# EAGLE design cir23 (EAGLE 7.6.0)
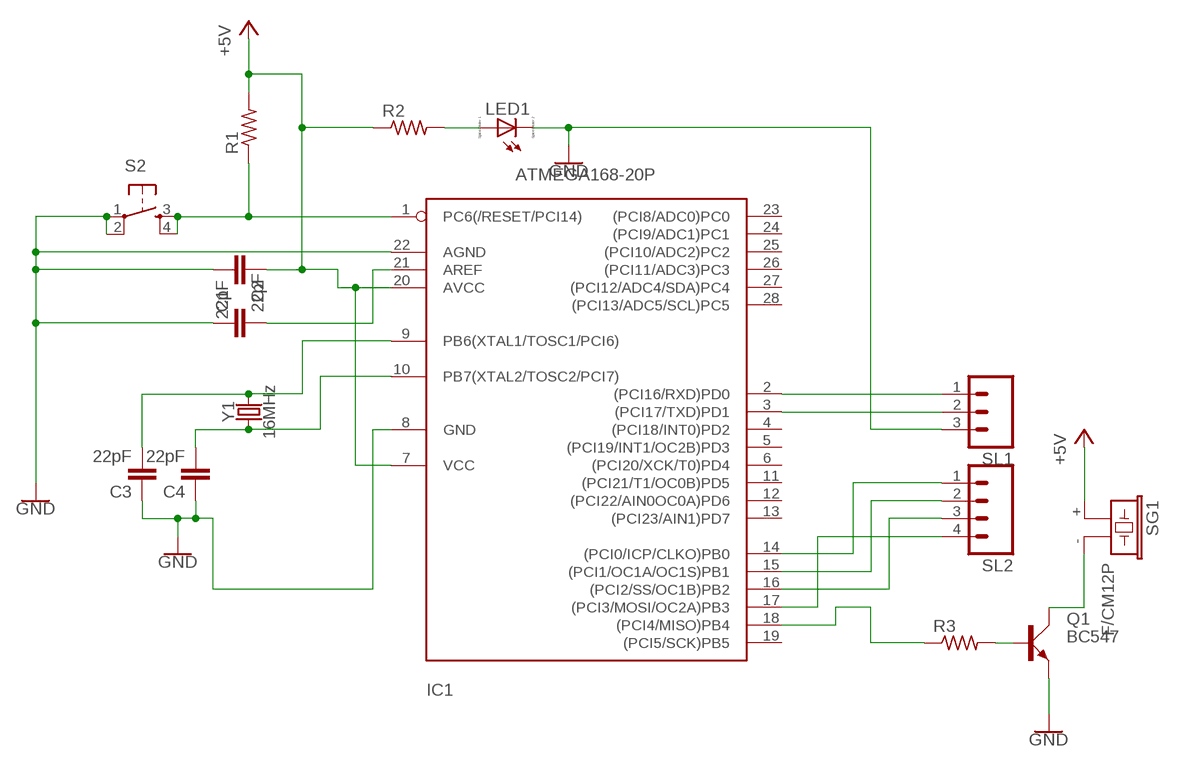
[diagram p0: schematic, sheet 1]

## Parts
C1  22pF  22PF-PTH-2.54MM-200V-5%  [CAP-PTH-2.54]
C2  22pF  22PF-PTH-2.54MM-200V-5%  [CAP-PTH-2.54]
C3  22pF  22PF-PTH-2.54MM-200V-5%  [CAP-PTH-2.54]
C4  22pF  22PF-PTH-2.54MM-200V-5%  [CAP-PTH-2.54]
IC1  ATMEGA168-20P  [DIL28-3]
LED1  LED_ELD260  [LED_LD260]
Q1  BC547  [SOT54A]
R1  R-US_0204/7  [0204/7]
R2  R-US_0204/7  [0204/7]
R3  R-US_0204/7  [0204/7]
S2  TAC_SWITCHPTH  [TACTILE-PTH]
SG1  F/CM12P  [F/CM12P]
SL1  MA03  [03P]
SL2  MA04  [04PA]
Y1  16MHz  CRYSTAL-16MHZPTH-HC49US  [HC49US]

## Nets
+5V: C2.1 IC1.7(VCC) IC1.20(AVCC) R1.2 R2.1 SG1.+
GND: C1.1 C2.2 C3.1 C4.1 IC1.8(GND) IC1.22(AGND) LED1.K(C) Q1.E S2.1 S2.2 SL1.3
N$1: IC1.1(PC6(/RESET/PCI14)) R1.1 S2.3 S2.4
N$2: IC1.14((PCI0/ICP/CLKO)PB0) SL2.1
N$3: C1.2 IC1.21(AREF)
N$4: C3.2 IC1.9(PB6(XTAL1/TOSC1/PCI6)) Y1.2
N$5: C4.2 IC1.10(PB7(XTAL2/TOSC2/PCI7)) Y1.1
N$6: IC1.15((PCI1/OC1A/OC1S)PB1) SL2.2
N$7: IC1.16((PCI2/SS/OC1B)PB2) SL2.3
N$8: IC1.17((PCI3/MOSI/OC2A)PB3) SL2.4
N$9: IC1.18((PCI4/MISO)PB4) R3.1
N$10: LED1.A R2.2
N$11: IC1.2((PCI16/RXD)PD0) SL1.1
N$12: IC1.3((PCI17/TXD)PD1) SL1.2
N$13: Q1.B R3.2
N$14: Q1.C SG1.-
Unconnected: IC1.4((PCI18/INT0)PD2) IC1.5((PCI19/INT1/OC2B)PD3) IC1.6((PCI20/XCK/T0)PD4) IC1.11((PCI21/T1/OC0B)PD5) IC1.12((PCI22/AIN0OC0A)PD6) IC1.13((PCI23/AIN1)PD7) IC1.19((PCI5/SCK)PB5) IC1.23((PCI8/ADC0)PC0) IC1.24((PCI9/ADC1)PC1) IC1.25((PCI10/ADC2)PC2) IC1.26((PCI11/ADC3)PC3) IC1.27((PCI12/ADC4/SDA)PC4) IC1.28((PCI13/ADC5/SCL)PC5)

## Library data of the parts
C1-C4 = SparkFun-Capacitors:22PF: 22pF ceramic capacitors A capacitor is a passive two-terminal electrical component used to store electrical energy temporarily in an electric field.; PROD_ID: CAP-09128
IC1 = adafruit:ATMEGA168*P: MICROCONTROLLER 16 kBytes FLASH 1 kBytes SRAM 512 Bytes EEPROM USART 8-channel 10 bit ADC
LED1 = eagle-ltspice:LED_E: LED Source: http://www.osram.convergy.de Source: www.luxeon.com Source: www.kingbright.com; SPICEMODEL: NONE; SPICEPREFIX: D; SPICETYPE: diode
Q1 = transistor-small-signal:BC547: NPN TRANSISTOR
R1-R3 = rcl:R-US_: RESISTOR, American symbol
S2 = SparkFun-Retired:TAC_SWITCH: Momentary Switch Button commonly used for reset or general input. Spark Fun Electronics SKU : COM-00097 SMT- SWCH-08247
SG1 = buzzer:F/CM12P: BUZZER Source: Buerklin; OC_FARNELL: unknown; OC_NEWARK: unknown
SL1 = con-amp-quick:MA03: AMP QUICK CONNECTOR; OC_FARNELL: unknown; OC_NEWARK: unknown
SL2 = con-amp-quick:MA04: AMP QUICK CONNECTOR; OC_FARNELL: unknown; OC_NEWARK: unknown
Y1 = SparkFun-Clocks:CRYSTAL-16MHZ: 16MHz Crystal Digikey Example <http://www.digikey.com/product-search/en?keywords=535-9122-1-ND> Frequency: 16MHz Frequency Stability: ±50ppm Frequency Tolerance: ±20ppm Load Capacitance: 18pF SparkFun Products: Pro Micro -5V/16MHz <https://www.sparkfun.com/products/12640> SparkFun Serial Enabled LCD Kit <https://www.sparkfun.com/products/10097>; PROD_ID: XTAL-08181; SF_ID: COM-00536

## Board
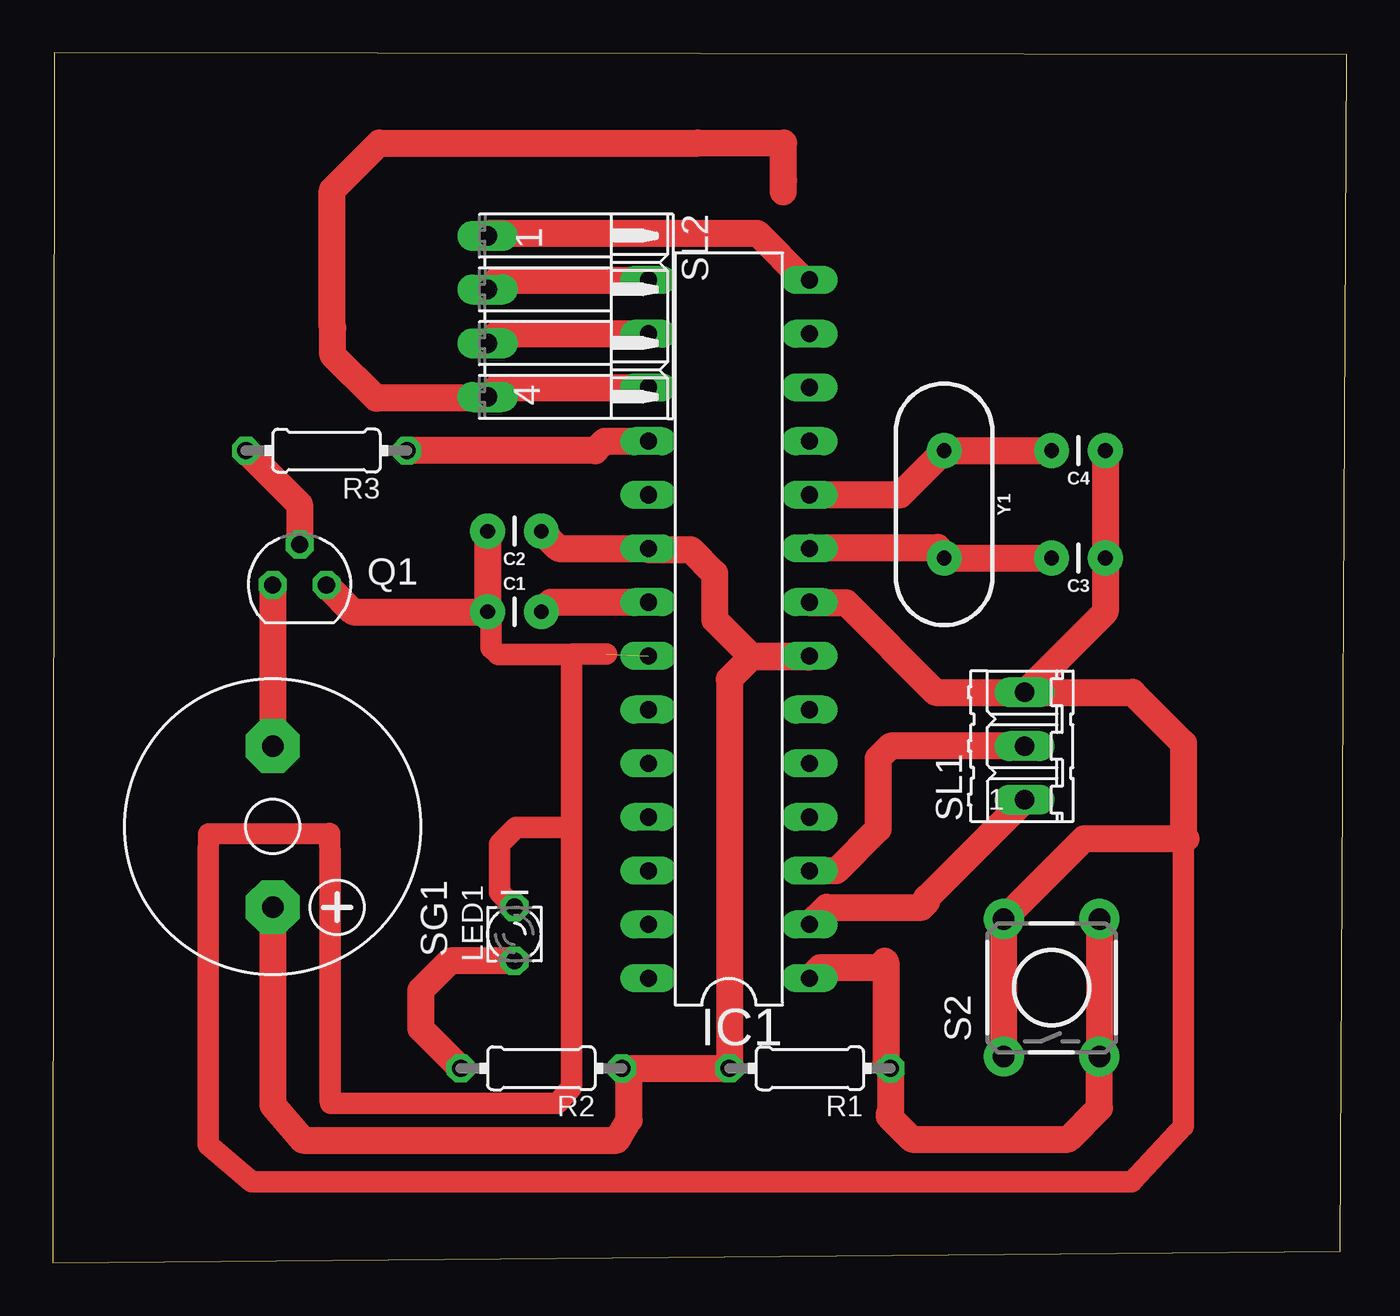
[diagram p1: board, top side]

Size 61.18 x 57.22 mm. Coordinates in mm from the lower left corner, seen from the top.
Outline: 0,0 60.88,0.55 61.18,57.13 0.05,57.22 0,0
Copper layers (1*16): Top 0.035mm / dielectric 1.5mm / Bottom 0.035mm
Design rules "default": minimum track width 10mil, minimum drill 24mil, track to track 8mil, track to pad 8mil, pad to pad 8mil, via to via 8mil, smd to smd 8mil, copper to edge 40mil, drill to drill 8mil, minimum pad ring 10mil, minimum via ring 8mil, stop-mask expansion 4mil, vias tented up to drill 0mil, thermal gap 10mil

### Footprints (pad centres in the part's own frame; a part is rotated, then mirrored left to right if it is on the bottom)
CAP-PTH-2.54 = drill 0.7 pad 1.651: 1 -1.27,0; 2 1.27,0
DIL28-3 = drill 0.813 long: 1 -16.51,-3.81; 2 -13.97,-3.81; 3 -11.43,-3.81; 4 -8.89,-3.81; 5 -6.35,-3.81; 6 -3.81,-3.81; 7 -1.27,-3.81; 8 1.27,-3.81; 9 3.81,-3.81; 10 6.35,-3.81; 11 8.89,-3.81; 12 11.43,-3.81; 13 13.97,-3.81; 14 16.51,-3.81; 15 16.51,3.81; 16 13.97,3.81; 17 11.43,3.81; 18 8.89,3.81; 19 6.35,3.81; 20 3.81,3.81; 21 1.27,3.81; 22 -1.27,3.81; 23 -3.81,3.81; 24 -6.35,3.81; 25 -8.89,3.81; 26 -11.43,3.81; 27 -13.97,3.81; 28 -16.51,3.81
LED_LD260 = drill 0.813 octagon: A -1.27,0; K 1.27,0
SOT54A = drill 0.813 octagon: B 0,1.905; C -1.27,0; E 1.27,0
0204/7 = drill 0.813 octagon: 1 -3.81,0; 2 3.81,0
TACTILE-PTH = drill 1.016 pad 1.88: 1 -3.251,2.261; 2 3.251,2.261; 3 -3.251,-2.261; 4 3.251,-2.261
F/CM12P = drill 1.016 pad 2.54 octagon: + 3.81,0; - -3.81,0
03P = drill 0.914 long: 1 -2.54,0; 2 0,0; 3 2.54,0
04PA = drill 0.914 long: 1 -3.81,0; 2 -1.27,0; 3 1.27,0; 4 3.81,0
HC49US = drill 0.7 pad 1.651: 1 -2.54,0; 2 2.54,0

### Placement (x,y rotation side)
C1  21.83,30.79 0 top
C2  21.83,34.6 180 top
C3  48.5,33.33 180 top
C4  48.5,38.41 180 top
IC1  31.97,29.97 90 top
LED1  21.83,15.55 90 top
Q1  11.67,32.06 0 top
R1  35.8,9.2 180 top
R2  23.1,9.2 180 top
R3  12.94,38.41 180 top
S2  47.23,13.01 90 top
SG1  10.4,20.63 270 top
SL1  45.96,24.44 90 top
SL2  20.56,44.76 270 top
Y1  42.15,35.87 270 top

### Tracks (layer width: path | path; a pad name or v marks a point on that pad's centre or on a via)
+5V
  Top 1.27: SG1.+ 10.4,7.48 11.83,5.81 26.67,5.81 27.25,6.76 27.25,8.86 R2.1 R1.2 31.99,27.61 33.03,28.65 35.73,28.65 IC1.7 33.01,28.7 31.29,30.42 31.29,32.61 30.17,33.73 28.22,33.73 IC1.20 23.92,33.78 C2.1
GND  (1 unrouted)
  Top 1.016: 26.19,28.8 24.58,28.8 24.54,28.76 | 24.54,28.76 24.54,20.6 | 24.54,20.6 24.54,8.32 23.88,7.55 13.14,7.55 13.1,7.7 13.1,18.97 13.09,20.32 7.37,20.29 7.33,19.22 7.33,5.59 9.4,3.84 51.02,3.84 53.46,6.45 53.46,20.56 | C1.1 20.71,30.64 20.71,29.09 21.04,28.76 24.54,28.76 | LED1.K 21.12,17.53 21.12,19.81 21.91,20.6 24.54,20.6
  Top 1.27: S2.1 S2.2 48.76,20.06 53.58,20.06 53.46,20.17 53.46,20.56 53.46,24.58 51.05,26.98 SL1.3 | C2.2 C1.1 14.21,30.79 Q1.E | C4.1 C3.1 49.77,30.79 SL1.3 | IC1.8 35.8,31.22 37.5,31.22 41.74,26.98 SL1.3
N$1
  Top 1.27: S2.4 S2.3 49.49,7.33 48.01,5.85 40.63,5.85 39.54,6.94 39.54,7.04 39.61,7.11 R1.1 39.39,9.42 39.39,13.97 | 39.34,14.28 39.39,14.23 39.39,13.97 | IC1.1 36.29,13.97 39.39,13.97
N$2
  Top 1.27: SL2.1 20.68,48.7 33.31,48.7 35.52,46.48 IC1.14
N$3
  Top 1.27: C1.2 23.55,31.24 IC1.21
N$4
  Top 1.27: C3.2 Y1.2 42.15,33.53 41.84,33.84 35.84,33.84 IC1.9
N$5
  Top 1.27: C4.2 Y1.1 40.06,36.32 IC1.10
N$6
  Top 1.27: SL2.2 21.01,46.48 IC1.15
N$7
  Top 1.27: SL2.3 21.01,43.94 IC1.16
N$8
  Top 1.27: 34.56,51.19 34.53,51.15 | 34.53,51.15 34.53,50.65 | 34.53,51.15 34.53,52.93 34.57,52.97 30.5,52.95 15.43,52.95 13.21,50.73 13.21,44.23 13.23,44.21 13.23,42.94 15.29,40.89 20.49,40.89 SL2.4 21.01,41.4 IC1.17
N$9
  Top 1.27: R3.1 25.64,38.41 26.09,38.86 IC1.18
N$10
  Top 1.27: LED1.A 18.78,14.28 17.4,12.9 17.4,11.09 R2.2
N$11
  Top 1.27: SL1.1 41.33,17.27 41.33,17.08 41.07,16.82 36.6,16.82 IC1.2
N$12
  Top 1.27: SL1.2 39.61,24.44 39.02,23.86 39.02,20.51 37.05,18.54 IC1.3
N$13
  Top 1.27: R3.2 11.67,35.87 Q1.B
N$14
  Top 1.27: Q1.C SG1.-